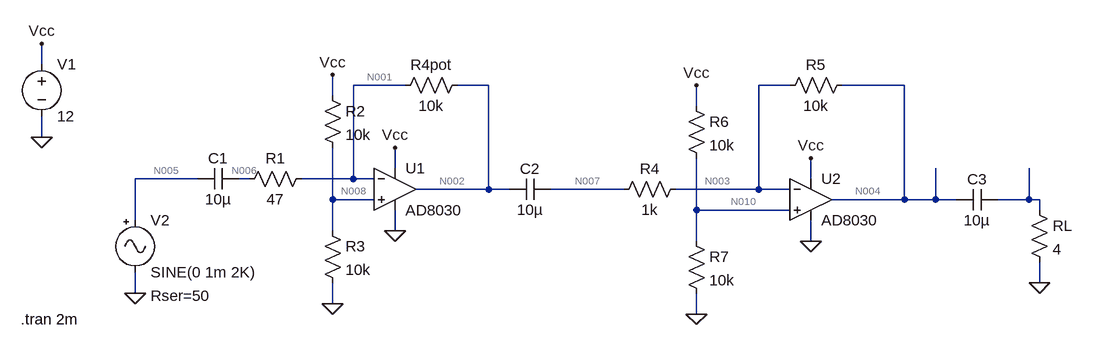
[diagram p0: schematic Phones Amplifier new.asc]
Phones Amplifier new.asc, the LTspice schematic file:
Version 4
SHEET 1 1300 680
WIRE -288 -32 -288 -64
WIRE 272 0 192 0
WIRE 400 0 352 0
WIRE 864 0 816 0
WIRE 1040 0 944 0
WIRE 160 16 160 -16
WIRE 720 32 720 0
WIRE -288 80 -288 48
WIRE 256 128 256 96
WIRE -48 144 -144 144
WIRE 32 144 16 144
WIRE 192 144 192 0
WIRE 192 144 112 144
WIRE 224 144 192 144
WIRE 896 144 896 112
WIRE 400 160 400 0
WIRE 400 160 288 160
WIRE 432 160 400 160
WIRE 608 160 496 160
WIRE 816 160 816 0
WIRE 816 160 688 160
WIRE 864 160 816 160
WIRE 160 176 160 96
WIRE 224 176 160 176
WIRE 1040 176 1040 0
WIRE 1040 176 928 176
WIRE 1088 176 1088 128
WIRE 1088 176 1040 176
WIRE 1120 176 1088 176
WIRE 1232 176 1232 128
WIRE 1232 176 1184 176
WIRE 1248 176 1232 176
WIRE 720 192 720 112
WIRE 864 192 720 192
WIRE 1248 192 1248 176
WIRE -144 208 -144 144
WIRE 160 224 160 176
WIRE 256 224 256 192
WIRE 720 240 720 192
WIRE 896 240 896 208
WIRE 1248 304 1248 272
WIRE -144 320 -144 288
WIRE 160 336 160 304
WIRE 720 352 720 320
FLAG 256 224 0
FLAG 896 240 0
FLAG 160 336 0
FLAG -288 80 0
FLAG -288 -64 Vcc
FLAG 160 -16 Vcc
FLAG 256 96 Vcc
FLAG 896 112 Vcc
FLAG -144 320 0
FLAG 1248 304 0
FLAG 720 352 0
FLAG 720 0 Vcc
SYMBOL cap 16 128 R90
WINDOW 0 0 32 VBottom 2
WINDOW 3 32 32 VTop 2
SYMATTR InstName C1
SYMATTR Value 10µ
SYMBOL res 128 128 R90
WINDOW 0 0 56 VBottom 2
WINDOW 3 32 56 VTop 2
SYMATTR InstName R1
SYMATTR Value 47
SYMBOL OpAmps\\AD8030 256 96 R0
SYMATTR InstName U1
SYMBOL OpAmps\\AD8030 896 112 R0
SYMATTR InstName U2
SYMBOL res 144 0 R0
SYMATTR InstName R2
SYMATTR Value 10k
SYMBOL res 144 208 R0
SYMATTR InstName R3
SYMATTR Value 10k
SYMBOL voltage -288 -48 R0
WINDOW 123 0 0 Left 0
WINDOW 39 0 0 Left 0
SYMATTR InstName V1
SYMATTR Value 12
SYMBOL res 368 -16 R90
WINDOW 0 0 56 VBottom 2
WINDOW 3 32 56 VTop 2
SYMATTR InstName R4pot
SYMATTR Value 10k
SYMBOL Misc\\signal -144 192 R0
WINDOW 123 0 0 Left 0
WINDOW 39 24 132 Left 2
SYMATTR InstName V2
SYMATTR Value SINE(0 1m 2K)
SYMATTR SpiceLine Rser=50
SYMBOL cap 496 144 R90
WINDOW 0 0 32 VBottom 2
WINDOW 3 32 32 VTop 2
SYMATTR InstName C2
SYMATTR Value 10µ
SYMBOL res 1232 176 R0
SYMATTR InstName RL
SYMATTR Value 4
SYMBOL res 704 144 R90
WINDOW 0 0 56 VBottom 2
WINDOW 3 32 56 VTop 2
SYMATTR InstName R4
SYMATTR Value 1k
SYMBOL res 960 -16 R90
WINDOW 0 0 56 VBottom 2
WINDOW 3 32 56 VTop 2
SYMATTR InstName R5
SYMATTR Value 10k
SYMBOL res 704 16 R0
SYMATTR InstName R6
SYMATTR Value 10k
SYMBOL res 704 224 R0
SYMATTR InstName R7
SYMATTR Value 10k
SYMBOL cap 1184 160 R90
WINDOW 0 0 32 VBottom 2
WINDOW 3 32 32 VTop 2
SYMATTR InstName C3
SYMATTR Value 10µ
TEXT -320 360 Left 2 !.tran 2m

The netlist it stands for:
* Phones Amplifier new.asc
C1 N006 N005 10µ
R1 N001 N006 47
XU1 N008 N001 Vcc 0 N002 AD8040  ; AD8030, pins In+ In- V+ V- OUT
XU2 N010 N003 Vcc 0 N004 AD8040  ; AD8030, pins In+ In- V+ V- OUT
R2 Vcc N008 10k
R3 N008 0 10k
V1 Vcc 0 12
R4pot N002 N001 10k
V2 N005 0 SINE(0 1m 2K) Rser=50
C2 N007 N002 10µ
RL N009 0 4
R4 N003 N007 1k
R5 N004 N003 10k
R6 Vcc N010 10k
R7 N010 0 10k
C3 N009 N004 10µ
.tran 2m
.lib ADI.lib
.backanno
.end

* Results of the author's LTspice run, read from the files saved beside the schematic
* Operating Point, zero values left out:
*   V(n006) = 6.008 V
*   V(n001) = 6.008 V
*   V(vcc) = 12 V
*   V(n008) = 6.008 V
*   V(n002) = 5.992 V
*   V(n003) = 6.008 V
*   V(n010) = 6.008 V
*   V(n004) = 5.992 V
*   V(n007) = 6.008 V
*   I(R2) = 599.2 µA
*   I(R3) = 600.8 µA
*   I(R4pot) = -1.699 µA
*   I(R5) = -1.699 µA
*   I(R6) = 599.2 µA
*   I(R7) = 600.8 µA
*   I(V1) = -3.827 mA
*   Ix(u1:1) = -1.699 µA
*   Ix(u1:2) = -1.699 µA
*   Ix(u1:3) = 1.314 mA
*   Ix(u1:4) = -1.313 mA
*   Ix(u1:5) = 1.699 µA
*   Ix(u2:1) = -1.699 µA
*   Ix(u2:2) = -1.699 µA
*   Ix(u2:3) = 1.314 mA
*   Ix(u2:4) = -1.313 mA
*   Ix(u2:5) = 1.699 µA
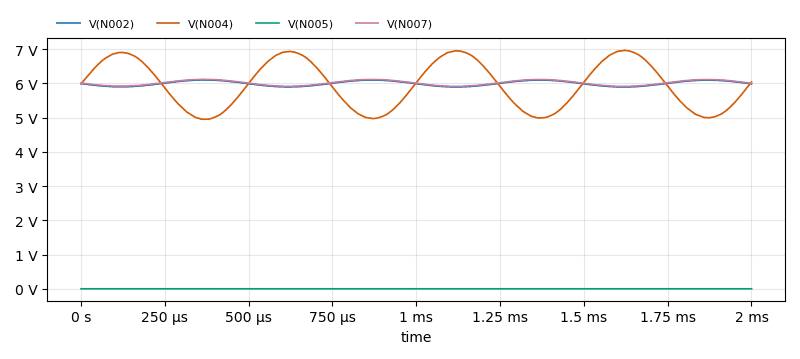
[diagram p1: Transient Analysis of Phones Amplifier new.asc, plotted from the saved traces]
* Transient Analysis, 1 run:
*   V(N002): min 5.893 V, max 6.097 V, average 5.995 V, rms 5.995 V, last 5.985 V
*   V(N004): min 4.95 V, max 6.961 V, average 5.954 V, rms 5.995 V, last 6.038 V
*   V(N005): min -492 µV, max 533.6 µV, average 17.36 µV, rms 355.9 µV, last -34.2 µV
*   V(N007): min 5.91 V, max 6.115 V, average 6.012 V, rms 6.013 V, last 6.001 V